# EAGLE schematic motherboard_Embedded (EAGLE 9.3.0)
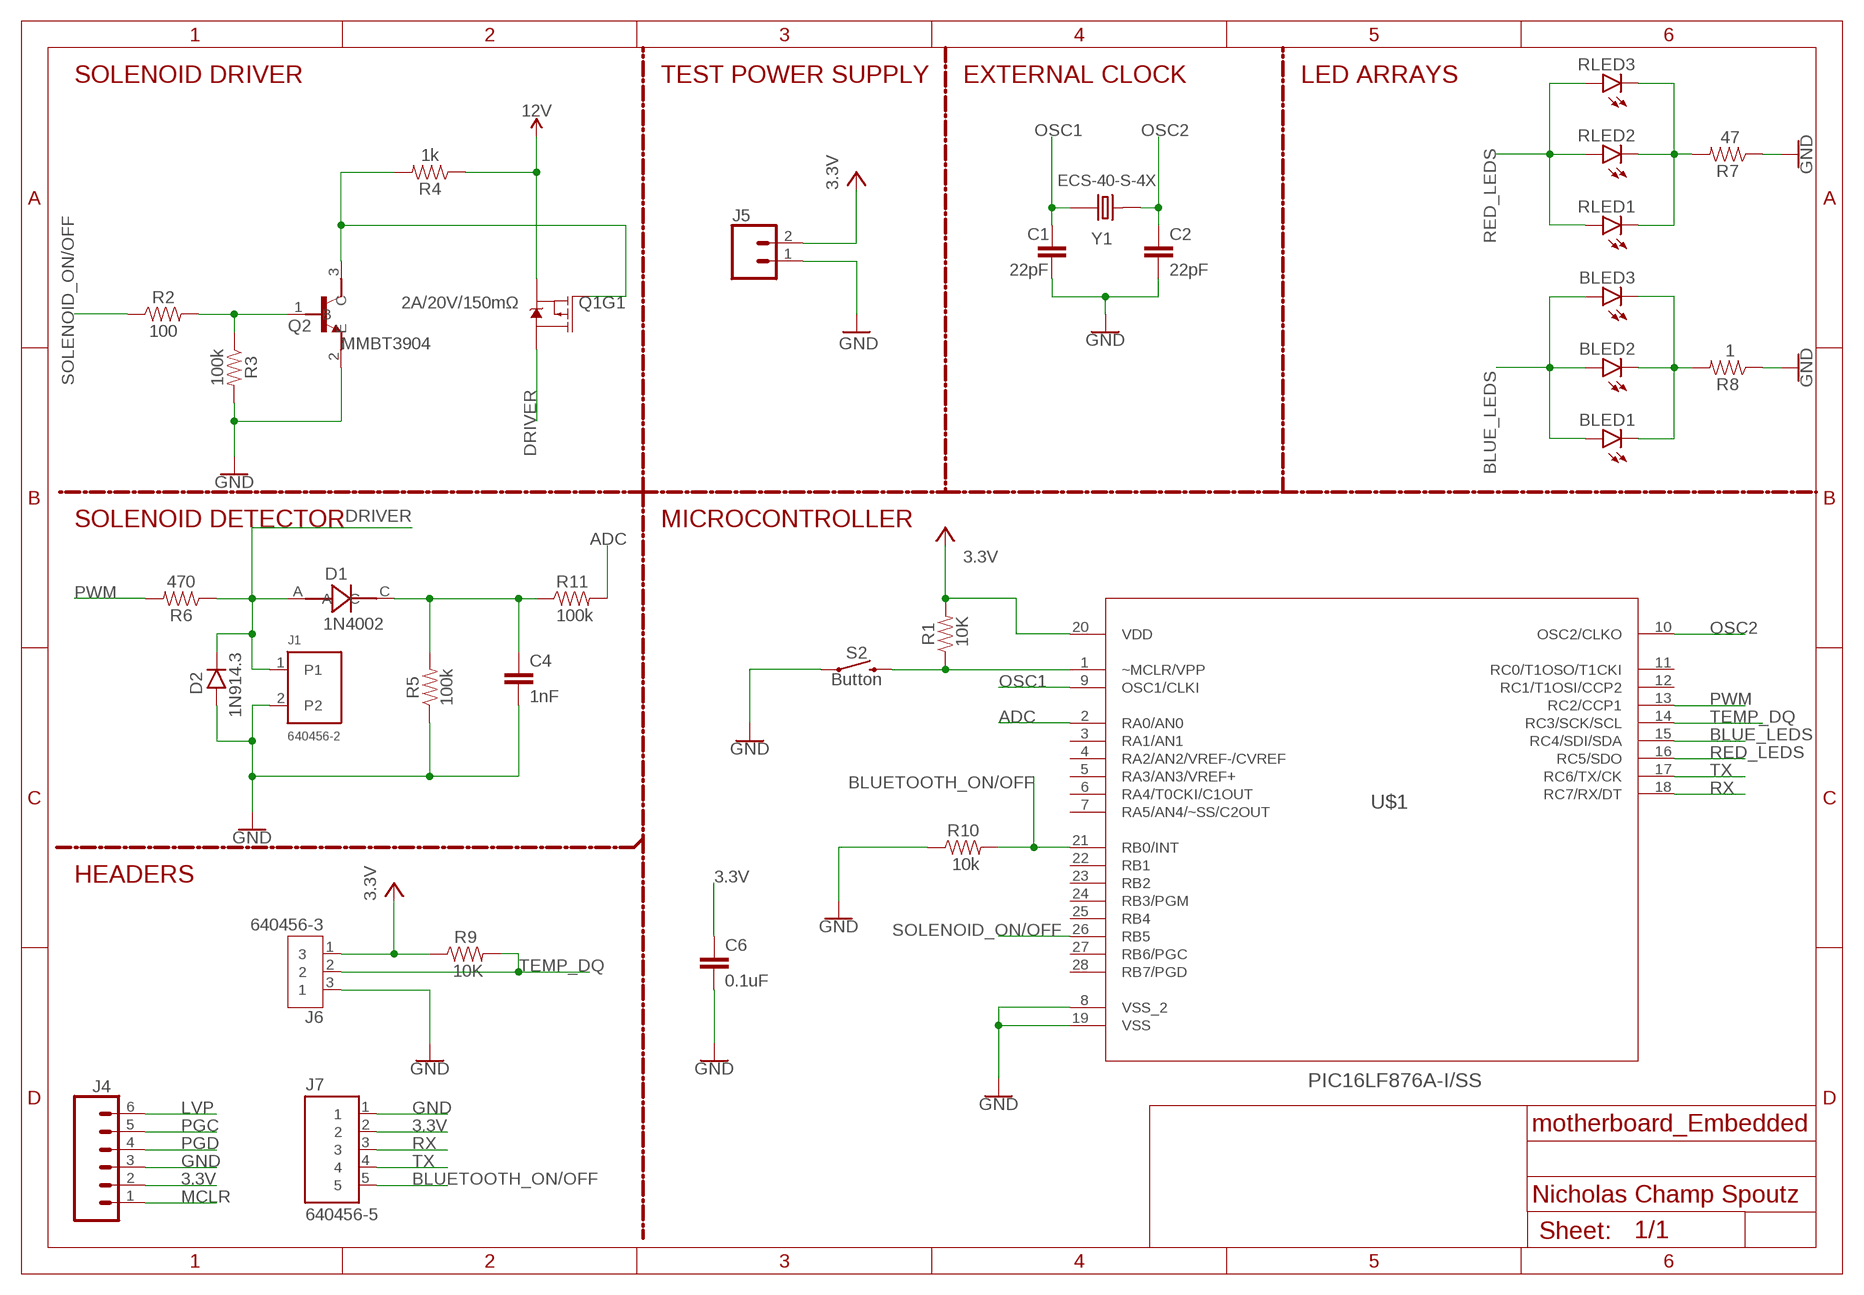
[diagram p0: schematic, sheet 1]

## Parts
BLED1  LED5MM  [LED5MM]
BLED2  LED5MM  [LED5MM]
BLED3  LED5MM  [LED5MM]
C1  22pF  22PF-0603-50V-5%  [0603]
C2  22pF  22PF-0603-50V-5%  [0603]
C4  1nF  1.0NF/1000PF-0603-50V-10%  [0603]
C6  0.1uF  0.1UF-0603-25V-5%  [0603]
D1  1N4002  [DIOAD520W79L463D238]
D2  1N914.3  [DO35-3]
J1  640456-2  [TE_640456-2]
J4  CONN_06SILK_FEMALE_PTH  [1X06]
J5  CONN_02  [1X02]
J6  640456-3  [CONN_640456-3]
J7  640456-5  [TE_640456-5]
Q1  2A/20V/150mΩ  MOSFET_PCH_DUAL-DMP2240UDM  [SOT26]
Q2  MMBT3904  [SOT95P240X120-3N]
R1  10K  RESISTOR0603  [0603]
R2  100  100OHM-0603-1/4W-5%  [0603]
R3  100k  100KOHM-0603-1/10W-1%  [0603]
R4  1k  1KOHM-0603-1/10W-1%  [0603]
R5  100k  100KOHM-0603-1/10W-1%  [0603]
R6  470  470OHM-0603-1/10W-1%  [0603]
R7  47  RESISTOR0603  [0603]
R8  1  RESISTOR0603  [0603]
R9  10K  RESISTOR0603  [0603]
R10  10k  RESISTOR0603  [0603]
R11  100k  RESISTOR0603  [0603]
RLED1  LED5MM  [LED5MM]
RLED2  LED5MM  [LED5MM]
RLED3  LED5MM  [LED5MM]
S2  Button  MOMENTARY-SWITCH-SPST-SMD-5.2MM  [TACTILE_SWITCH_SMD_5.2MM]
U$1  PIC16LF876A-I/SS  [SOP254P785X200-28N]
Y1  ECS-40-S-4X  [XTAL_ECS-40-S-4X]

## Nets
3.3V: C6.1 J4.2 J7.2 R1.2 U$1.20(VDD)
ADC: C4.1 D1.C R5.2 R11.1 R11.2 U$1.2(RA0/AN0)
BLUE_LEDS: BLED1.A BLED2.A BLED3.A U$1.15(RC4/SDI/SDA)
BLUETOOTH_ON/OFF: J7.5 R10.2 U$1.21(RB0/INT)
DRIVER: D1.A D2.C J1.1 Q1.D1(D) R6.1
GND: C1.2 C2.2 C4.2 C6.2 D2.A J1.2 J4.3 J5.1 J6.3 J7.1 Q2.2(E) R3.2 R5.1 R7.1 R8.1 R10.1 S2.1 U$1.8(VSS_2) U$1.19(VSS)
LVP: J4.6
MCLR: J4.1
N$1: Q2.1(B) R2.2 R3.1
N$3: Q1.G1(G) Q2.3(C) R4.2
N$4: BLED1.K(C) BLED2.K(C) BLED3.K(C) R8.2
N$5: R1.1 S2.3 U$1.1(~MCLR/VPP)
N$6: R7.2 RLED1.K(C) RLED2.K(C) RLED3.K(C)
OSC1: C1.1 U$1.9(OSC1/CLKI) Y1.1
OSC2: C2.1 U$1.10(OSC2/CLKO) Y1.2
PGC: J4.5
PGD: J4.4
PWM: R6.2 U$1.13(RC2/CCP1)
RED_LEDS: RLED1.A RLED2.A RLED3.A U$1.16(RC5/SDO)
RX: J7.3 U$1.18(RC7/RX/DT)
SOLENOID_ON/OFF: R2.1 U$1.26(RB5)
TEMP_DQ: J6.2 R9.2 U$1.14(RC3/SCK/SCL)
TX: J7.4 U$1.17(RC6/TX/CK)
VCC: J5.2 J6.1 Q1.S1(S) R4.1 R9.1 ; supply symbol labelled 3.3V, 12V
Unconnected: Q1.D2(D) Q1.G2(G) Q1.S2(S) U$1.3(RA1/AN1) U$1.4(RA2/AN2/VREF-/CVREF) U$1.5(RA3/AN3/VREF+) U$1.6(RA4/T0CKI/C1OUT) U$1.7(RA5/AN4/~SS/C2OUT) U$1.11(RC0/T1OSO/T1CKI) U$1.12(RC1/T1OSI/CCP2) U$1.22(RB1) U$1.23(RB2) U$1.24(RB3/PGM) U$1.25(RB4) U$1.27(RB6/PGC) U$1.28(RB7/PGD)

## Notes on the sheet
- SOLENOID DRIVER | TEST POWER SUPPLY | EXTERNAL CLOCK | LED ARRAYS
- SOLENOID DETECTOR | MICROCONTROLLER
- HEADERS
- Nicholas Champ Spoutz

## Library data of the parts
BLED1-BLED3 RLED1-RLED3 = led:LED: LED OSRAM: - CHIPLED LG R971, LG N971, LY N971, LG Q971, LY Q971, LO R971, LY R971 LH N974, LH R974 LS Q976, LO Q976, LY Q976 LO Q996 - Hyper CHIPLED LW Q18S LB Q993, LB Q99A, LB R99A - SideLED LS A670, LO A670, LY A670, LG A670, LP A670 LB A673, LV A673, LT A673, LW A673 LH A674 LY A675 LS A676, LA A676, LO A676, LY A676, LW A676 LS A679, LY A679, LG A679 - Hyper Micro SIDELED® LS Y876, LA Y876, LO Y876, LY Y876 LT Y87S - SmartLED LW L88C, LW L88S LB L89C, LB L89S, LG L890 LS L89K, LO L89K, LY L89K LS L896, LA L896, LO L896, LY L896 - TOPLED LS T670, LO T670, LY T670, LG T670, LP T670 LSG T670, LSP T670, LSY T670, LOP T670, LYG T670 LG T671, LOG T671, LSG T671 LB T673, LV T673, LT T673, LW T673 LH T674 LS T676, LA T676, LO T676, LY T676, LB T676, LH T676, LSB T676, LW T676 LB T67C, LV T67C, LT T67C, LS T67K, LO T67K, LY T67K, LW E67C LS E67B, LA E67B, LO E67B, LY E67B, LB E67C, LV E67C, LT E67C LW T67C LS T679, LY T679, LG T679 LS T770, LO T770, LY T770, LG T770, LP T770 LB T773, LV T773, LT T773, LW T773 LH T774 LS E675, LA E675, LY E675, LS T675 LS T776, LA T776, LO T776, LY T776, LB T776 LHGB T686 LT T68C, LB T68C - Hyper Mini TOPLED® LB M676 - Mini TOPLED Santana® LG M470 LS M47K, LO M47K, LY M47K Source: http://www.osram.convergy.de LUXEON: - LUMILED® LXK2-PW12-R00, LXK2-PW12-S00, LXK2-PW14-U00, LXK2-PW14-V00 LXK2-PM12-R00, LXK2-PM12-S00, LXK2-PM14-U00 LXK2-PE12-Q00, LXK2-PE12-R00, LXK2-PE12-S00, LXK2-PE14-T00, LXK2-PE14-U00 LXK2-PB12-K00, LXK2-PB12-L00, LXK2-PB12-M00, LXK2-PB14-N00, LXK2-PB14-P00, LXK2-PB14-Q00 LXK2-PR12-L00, LXK2-PR12-M00, LXK2-PR14-Q00, LXK2-PR14-R00 LXK2-PD12-Q00, LXK2-PD12-R00, LXK2-PD12-S00 LXK2-PH12-R00, LXK2-PH12-S00 LXK2-PL12-P00, LXK2-PL12-Q00, LXK2-PL12-R00 Source: www.luxeon.com KINGBRIGHT: KA-3528ASYC Source: www.kingbright.com
C1 C2 = SparkFun-Capacitors:22PF: 22pF ceramic capacitors A capacitor is a passive two-terminal electrical component used to store electrical energy temporarily in an electric field.; PROD_ID: CAP-07876
C4 = SparkFun-Capacitors:1.0NF/1000PF: 1nF/1,000pF ceramic capacitors A capacitor is a passive two-terminal electrical component used to store electrical energy temporarily in an electric field.; PROD_ID: CAP-07886
C6 = SparkFun-Capacitors:0.1UF: 0.1µF ceramic capacitors A capacitor is a passive two-terminal electrical component used to store electrical energy temporarily in an electric field.; PROD_ID: CAP-08604
D1 = 1N4002:1N4002: 1N400 Series 1.1 V 1 A 100 V Max Reverse Voltage Standard Rectifier - DO-41; AVAILABILITY: Unavailable; DESCRIPTION: Diode Gen Purp 100v 1a Do41; MF: ON Semiconductor; MP: 1N4002; PACKAGE: DO-204 MCC; PRICE: None
D2 = 1N914:1N914: Fast Switching Diode DO-35 glass case a.k.a. 1N4148; AVAILABILITY: Unavailable; DESCRIPTION: 1N914 Series 500 mW 100 V Max Reverse Voltage Small Signal Diode - DO-35; MF: Microsemi Corporation; MP: 1N914; PACKAGE: DO-35 ON Semiconductor; PRICE: None
J1 = 640456-2:640456-2: CONN HEADER VERT 2POS .100 TIN; COMMENT: 640456-2; DESCRIPTION: 02P MTA100 HDR ASSY F/L SQ STR; DIGI-KEY_PART_NUMBER: A1921-ND; DIGI-KEY_PURCHASE_URL: https://www.digikey.com/product-detail/en/te-connectivity-amp-connectors/640456-2/A1921-ND/109003?utm_source=snapeda&utm_medium=aggregator&utm_campaign=symbol; EU_ROHS_COMPLIANCE: Compliant; MF: TE Connectivity; MP: 640456-2; PACKAGE: None; TE_PURCHASE_URL: https://www.te.com/usa-en/product-640456-2.html?te_bu=Cor&te_type=disp&te_campaign=seda_glo_cor-seda-global-disp-prtnr-fy19-seda-model-bom-cta_sma-317_1&elqCampaignId=32493
J4 = SparkFun-Connectors:CONN_06: Multi connection point. Often used as Generic Header-pin footprint for 0.1 inch spaced/style header connections On any of the 0.1 inch spaced packages, you can populate with these: Break Away Headers - Straight <https://www.sparkfun.com/products/116> (PRT-00116) Break Away Male Headers - Right Angle <https://www.sparkfun.com/products/553> (PRT-00553) Female Headers <https://www.sparkfun.com/products/115> (PRT-00115) Break Away Headers - Machine Pin <https://www.sparkfun.com/products/117> (PRT-00117) Break Away Female Headers - Swiss Machine Pin <https://www.sparkfun.com/products/743> (PRT-00743) Arduino Stackable Header - 6 Pin <https://www.sparkfun.com/products/9280> (PRT-09280) For SCREWTERMINALS and SPRING TERMINALS visit here: Screw Terimnals on SparkFun.com <https://www.sparkfun.com/search/results?term=Screw+Terminals> (5mm/3.5mm/2.54mm spacing) This device is also useful as a general connection point to wire up your design to another part of your project. Our various solder wires solder well into these plated through hole pads. Hook-Up Wire - Assortment (Stranded, 22 AWG) <https://www.sparkfun.com/products/11375> (PRT-11375) Hook-Up Wire - Assortment (Solid Core, 22 AWG) <https://www.sparkfun.com/products/11367> (PRT-11367) View the entire wire category on our website here <https://www.sparkfun.com/categories/141>; PROD_ID: CONN-08437
J5 = SparkFun-Connectors:CONN_02: Multi connection point. Often used as Generic Header-pin footprint for 0.1 inch spaced/style header connections On any of the 0.1 inch spaced packages, you can populate with these: Break Away Headers - Straight <https://www.sparkfun.com/products/116> (PRT-00116) Break Away Male Headers - Right Angle <https://www.sparkfun.com/products/553> (PRT-00553) Female Headers <https://www.sparkfun.com/products/115> (PRT-00115) Break Away Headers - Machine Pin <https://www.sparkfun.com/products/117> (PRT-00117) Break Away Female Headers - Swiss Machine Pin <https://www.sparkfun.com/products/743> (PRT-00743) For SCREWTERMINALS and SPRING TERMINALS visit here: Screw Terimnals on SparkFun.com <https://www.sparkfun.com/search/results?term=Screw+Terminals> (5mm/3.5mm/2.54mm spacing) This device is also useful as a general connection point to wire up your design to another part of your project. Our various solder wires solder well into these plated through hole pads. Hook-Up Wire - Assortment (Stranded, 22 AWG) <https://www.sparkfun.com/products/11375> (PRT-11375) Hook-Up Wire - Assortment (Solid Core, 22 AWG) <https://www.sparkfun.com/products/11367> (PRT-11367) View the entire wire category on our website here <https://www.sparkfun.com/categories/141> Special notes: Molex polarized connector foot print use with: PRT-08233 with associated crimp pins and housings. 2.54_SCREWTERM for use with PRT-10571. 3.5mm Screw Terminal footprints for PRT-08084 5mm Screw Terminal footprints for use with PRT-08432
J6 = 640456-3:640456-3: Header, Friction Lock; MTA-100; 3; 250 VAC; Polyester; Tin; Copper Alloy; Tin; COMMENT: 640456-3; DESCRIPTION: 03P MTA100 HDR ASSY F/L SQ STR; DIGI-KEY_PART_NUMBER: A19470-ND; DIGI-KEY_PURCHASE_URL: https://www.digikey.com/product-detail/en/te-connectivity-amp-connectors/640456-3/A19470-ND/259010?utm_source=snapeda&utm_medium=aggregator&utm_campaign=symbol; EU_ROHS_COMPLIANCE: Compliant; MF: TE Connectivity; MP: 640456-3; PACKAGE: None; TE_PURCHASE_URL: https://www.te.com/usa-en/product-640456-3.html?te_bu=Cor&te_type=disp&te_campaign=seda_glo_cor-seda-global-disp-prtnr-fy19-seda-model-bom-cta_sma-317_1&elqCampaignId=32493
J7 = 640456-5:640456-5: CONN HEADER VERT 5POS .100 TIN; CENTERLINE_PITCH: 2.54 mm[.1 in]; COMMENT: 640456-5; DESCRIPTION: 05P MTA100 HDR ASSY F/L SQ STR; DIGI-KEY_PART_NUMBER: A19471-ND; DIGI-KEY_PURCHASE_URL: https://www.digikey.com/product-detail/en/te-connectivity-amp-connectors/640456-5/A19471-ND/259011?utm_source=snapeda&utm_medium=aggregator&utm_campaign=symbol; EU_ROHS_COMPLIANCE: Compliant; MF: TE Connectivity; MP: 640456-5; NUMBER_OF_POSITIONS: 5; PACKAGE: None; PRODUCT_TYPE: Connector; TE_PURCHASE_URL: https://www.te.com/usa-en/product-640456-5.html?te_bu=Cor&te_type=disp&te_campaign=seda_glo_cor-seda-global-disp-prtnr-fy19-seda-model-bom-cta_sma-317_1&elqCampaignId=32493
Q1 = SparkFun-DiscreteSemi:MOSFET_PCH_DUAL: Dual P-Channel -20VDS MOSFET Link to datasheet <http://www.diodes.com/_files/datasheets/ds31197.pdf> SparkFun Products: SparkFun FreeSoC2 Development Board <https://www.sparkfun.com/products/13229>; PROD_ID: TRANS-12444
Q2 = MMBT3904:MMBT3904: MMBT3904 Series 40 V CE Breakdown 0.2 A NPN General Purpose Amplifier - SOT-23; DESCRIPTION: SOT-23, 60V, 0.2A, NPN Bipolar Transistor; DIGI-KEY_PART_NUMBER: 497-2478-1-ND; DIGI-KEY_PURCHASE_URL: https://www.digikey.com/product-detail/en/stmicroelectronics/MMBT3904/497-2478-1-ND/603860?utm_source=snapeda&utm_medium=aggregator&utm_campaign=symbol; MF: STMicroelectronics; MP: MMBT3904; PACKAGE: SOT-23-3 Taiwan Semiconductor
R1 R7-R11 = SparkFun-Resistors:RESISTOR: Generic Resistor Package
R2 = SparkFun-Resistors:100OHM: 100Ω resistor A resistor is a passive two-terminal electrical component that implements electrical resistance as a circuit element. Resistors act to reduce current flow, and, at the same time, act to lower voltage levels within circuits. - Wikipedia; PROD_ID: RES-12438
R3 R5 = SparkFun-Resistors:100KOHM: 100kΩ resistor A resistor is a passive two-terminal electrical component that implements electrical resistance as a circuit element. Resistors act to reduce current flow, and, at the same time, act to lower voltage levels within circuits. - Wikipedia; PROD_ID: RES-07828
R4 = SparkFun-Resistors:1KOHM: 1kΩ resistor A resistor is a passive two-terminal electrical component that implements electrical resistance as a circuit element. Resistors act to reduce current flow, and, at the same time, act to lower voltage levels within circuits. - Wikipedia; PROD_ID: RES-07856
R6 = SparkFun-Resistors:470OHM: 470Ω resistor A resistor is a passive two-terminal electrical component that implements electrical resistance as a circuit element. Resistors act to reduce current flow, and, at the same time, act to lower voltage levels within circuits. - Wikipedia; PROD_ID: RES-07869
S2 = SparkFun-Switches:MOMENTARY-SWITCH-SPST: Momentary Switch (Pushbutton) - SPST Normally-open (NO) SPST momentary switches (buttons, pushbuttons). Variants PTH-12MM - 12mm square, through-hole Momentary Pushbutton Switch - 12mm Square <https://www.sparkfun.com/products/9190> (COM-09190) PTH-6.0MM, PTH-6.0MM-KIT - 6.0mm square, through-hole Mini Pushbutton Switch <https://www.sparkfun.com/products/97> (COM-00097) KIT package intended for soldering kit's - only one side of pads' copper is exposed. PTH-RIGHT-ANGLE-KIT - Right-angle, through-hole Right Angle Tactile Button <https://www.sparkfun.com/products/10791> - Used on SparkFun BigTime Watch Kit <https://www.sparkfun.com/products/11734> SMD-12MM - 12mm square, surface-mount Tactile Button - SMD (12mm) <https://www.sparkfun.com/products/12993> (COM-12993) Used on SparkFun PicoBoard <https://www.sparkfun.com/products/11888> SMD-4.5MM - 4.5mm Square Trackball Switch Used on SparkFun Blackberry Trackballer Breakout <https://www.sparkfun.com/products/13169> SMD-4.6MMX2.8MM - 4.60mm x 2.80mm, surface mount Used on SparkFun SAMD21 Mini Breakout <https://www.sparkfun.com/products/13664> SMD-5.2MM, SMD-5.2-REDUNDANT - 5.2mm square, surface-mount Mini Pushbutton Switch - SMD <https://www.sparkfun.com/products/8720> (COM-08720) Used on Arduino Pro Mini <https://www.sparkfun.com/products/11114> REDUNDANT package connects both switch circuits together SMD-6.0X3.5MM - 6.0 x 3.5mm, surface mount Momentary Reset Switch SMD <https://www.sparkfun.com/products/8229> (COM-08229) SMD-6.2MM-TALL - 6.2mm square, surface mount Tactile Button - SMD (6mm) <https://www.sparkfun.com/products/12992> Used on SparkFun Digital Sandbox <https://www.sparkfun.com/products/12651> SMD-RIGHT-ANGLE - Right-angle, surface mount Used on SparkFun Block for Intel® Edison - Arduino <https://www.sparkfun.com/products/13036>; PROD_ID: SWCH-08247; SF_SKU: COM-08720
U$1 = PIC16LF876A-I_SS:PIC16LF876A-I/SS: Microcontrollers; AVAILABILITY: Unavailable; DESCRIPTION: PIC16 Series 368 B RAM 14 kB Flash 8-Bit Enhanced Microcontroller - SSOP-28; MF: Microchip; MP: PIC16LF876A-I/SS; PACKAGE: SSOP-28 Microchip; PRICE: None
Y1 = ECS-40-S-4X:ECS-40-S-4X: CRYSTAL T/H; DESCRIPTION: Crystal 4MHz Series 2-Pin HC-49/U; DIGI-KEY_PART_NUMBER: X1044-ND; DIGI-KEY_PURCHASE_URL: https://www.digikey.com/product-detail/en/ecs-inc/ECS-40-S-4X/X1044-ND/827536?utm_source=snapeda&utm_medium=aggregator&utm_campaign=symbol; MF: ECS Inc.; MP: ECS-40-S-4X; PACKAGE: HC49/US ECS International